# Altium schematic sheet BOC_IO.SchDoc: Board-On-Chip User Header Ports
size A; Organization: Altium Limited; Address1: L3, 12a Rodborough Rd; Address2: Frenchs Forest; Address3: NSW; Address4: Australia 2086; Revision: 1.06; SheetNumber: 11; SheetTotal: 16
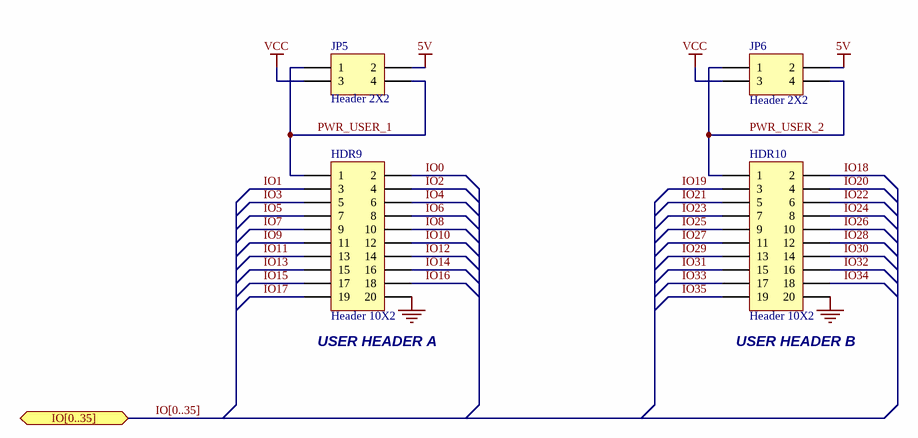
[diagram p0: BOC_IO.SchDoc]

## Parts
HDR9  Header 10X2  [HDR2X10]
HDR10  Header 10X2  [HDR2X10]
JP5  Header 2X2  [HDR2X2_B]
JP6  Header 2X2  [HDR2X2_B]

## Ports
IO[0..35] (bidir)

## Nets
5V: JP5.2 JP6.2
GND: HDR9.20 HDR10.20
VCC: JP5.3 JP6.3
IO0: HDR9.2
IO1: HDR9.3
IO2: HDR9.4
IO3: HDR9.5
IO4: HDR9.6
IO5: HDR9.7
IO6: HDR9.8
IO7: HDR9.9
IO8: HDR9.10
IO9: HDR9.11
IO10: HDR9.12
IO11: HDR9.13
IO12: HDR9.14
IO13: HDR9.15
IO14: HDR9.16
IO15: HDR9.17
IO16: HDR9.18
IO17: HDR9.19
IO18: HDR10.2
IO19: HDR10.3
IO20: HDR10.4
IO21: HDR10.5
IO22: HDR10.6
IO23: HDR10.7
IO24: HDR10.8
IO25: HDR10.9
IO26: HDR10.10
IO27: HDR10.11
IO28: HDR10.12
IO29: HDR10.13
IO30: HDR10.14
IO31: HDR10.15
IO32: HDR10.16
IO33: HDR10.17
IO34: HDR10.18
IO35: HDR10.19
PWR_USER_1: HDR9.1 JP5.1 JP5.4
PWR_USER_2: HDR10.1 JP6.1 JP6.4

## Buses and harness runs
bus IO[0..35] = port IO[0..35]

## Notes on the sheet
- (near HDR9) USER HEADER A
- (near HDR10) USER HEADER B
- Title
- Size:
- Date:
- A
- Number:
- Time:
- Revision:
- Sheet
- of
- File:

## Library data of the parts
HDR9 HDR10 = Header 10X2: Header, 10-Pin, Dual row; Manufacturer: Generic Components; Class I: Connector; Fitted: True; Revision: July-2002: Re-released for DXP Platform.; Publisher: Altium Limited
JP5 JP6 = Header 2X2: Header, 2-Pin, Dual row; Manufacturer: Generic Components; Class I: Connector; Fitted: True; Revision: July-2002: Re-released for DXP Platform.; Publisher: Altium Limited